# EAGLE design rotary-encoder-breakout-mk-1.1 (EAGLE 6.5.0)
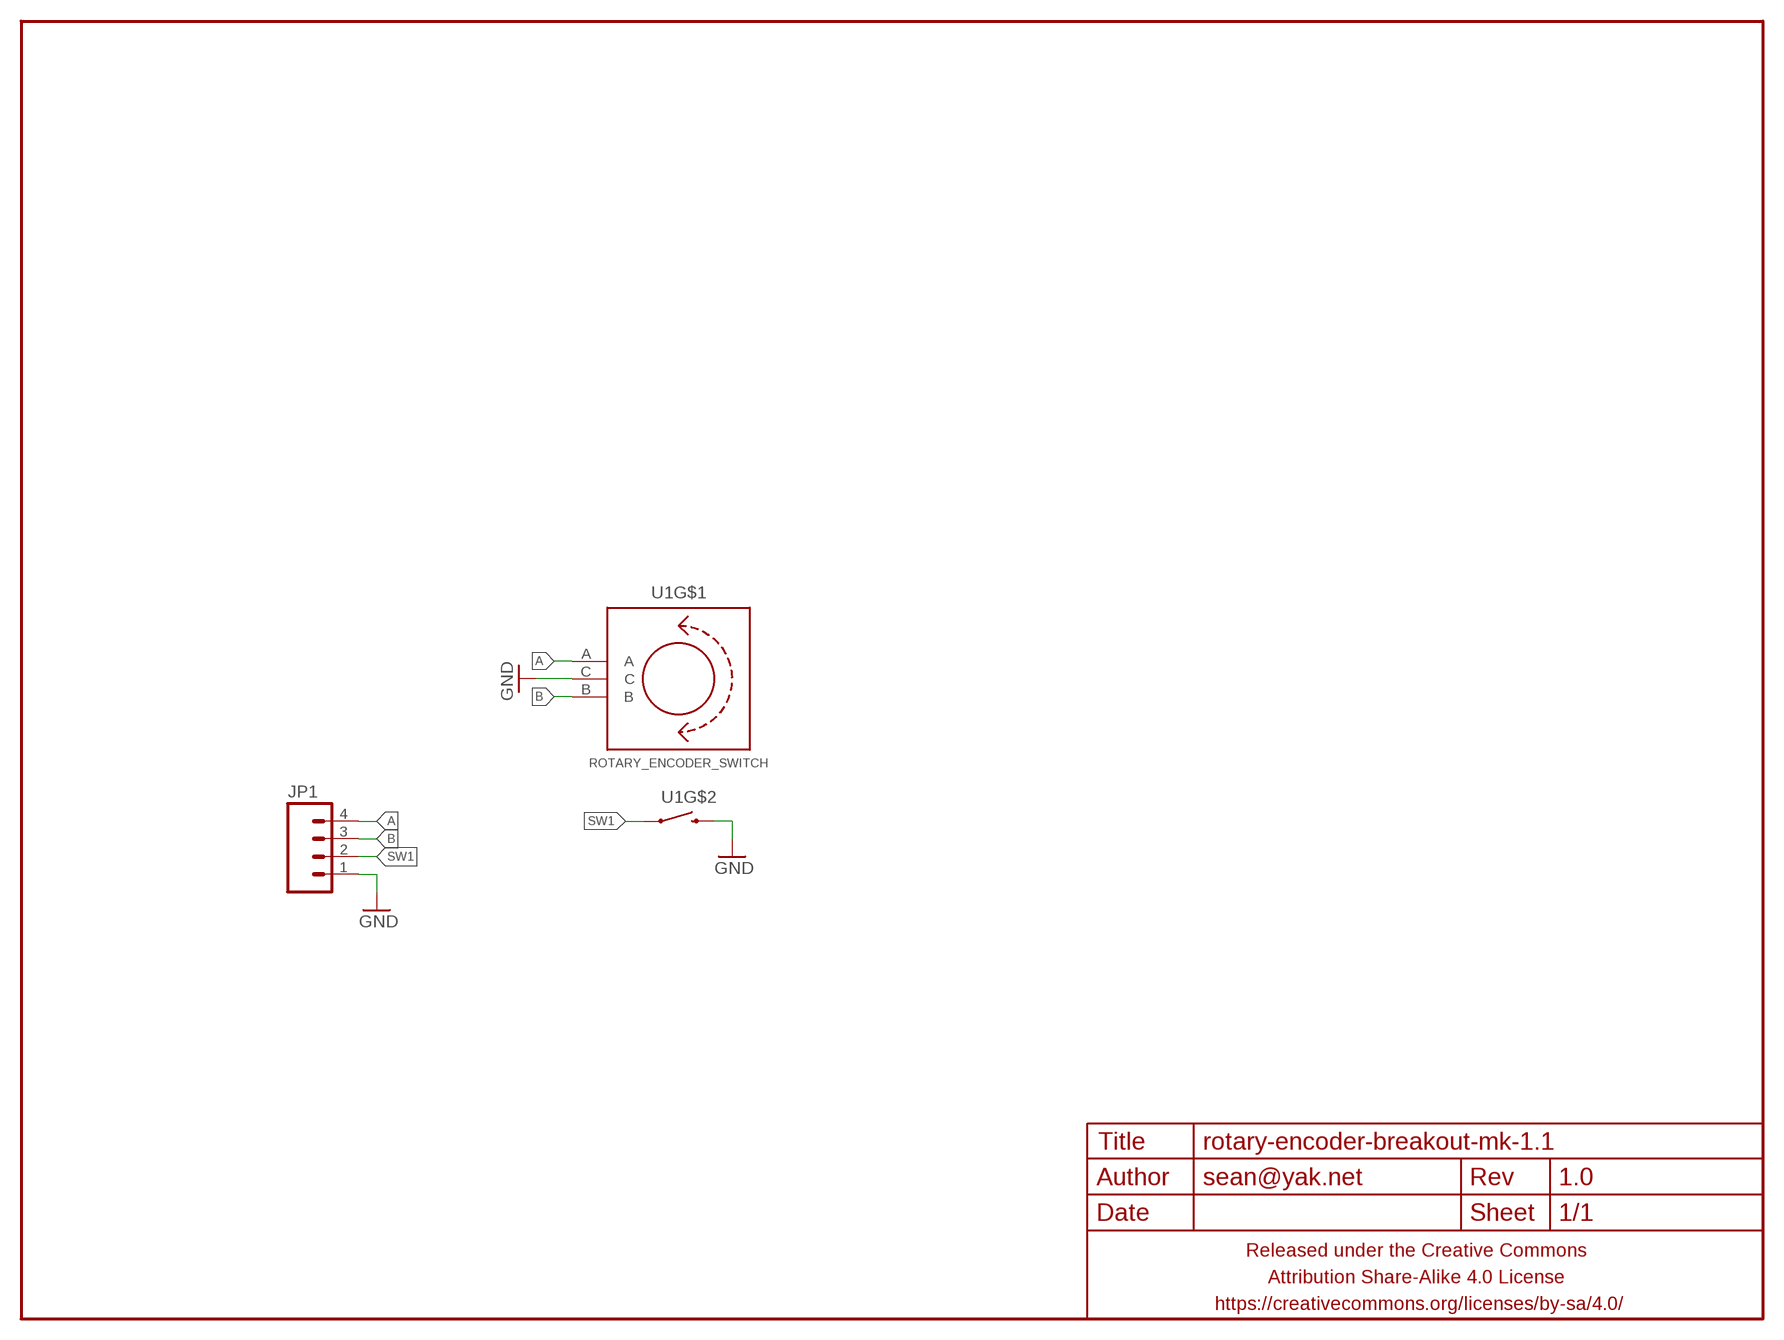
[diagram p0: schematic, sheet 1]

## Parts
FRAME1  FRAME-LETTERNO_PACKAGE  [DUMMY]
JP1  M04PTH  [1X04-PTH-VERT]
U1  ROTARY_ENCODER_SWITCH  [ROTARY_ENCODER_SWITCH]

## Nets
A: JP1.4 U1.A
B: JP1.3 U1.B
GND: JP1.1 U1.C U1.SW2
SW1: JP1.2 U1.SW1

## Library data of the parts
FRAME1 = A_butts:FRAME-LETTER: Schematic Frame Standard 8.5x11 US Letter frame; DESIGNER: sean@yak.net; VERSION: 1.0
JP1 = A_butts:M04: Header 4 Standard 4-pin 0.1" header. Use with straight break away headers (SKU : PRT-00116), right angle break away headers (PRT-00553), swiss pins (PRT-00743), machine pins (PRT-00117), and female headers (PRT-00115). Molex polarized connector foot print use with SKU : PRT-08231 with associated crimp pins and housings. 1MM SMD Version SKU: PRT-10208
U1 = A_butts:ROTARY_ENCODER_SWITCH

## Board
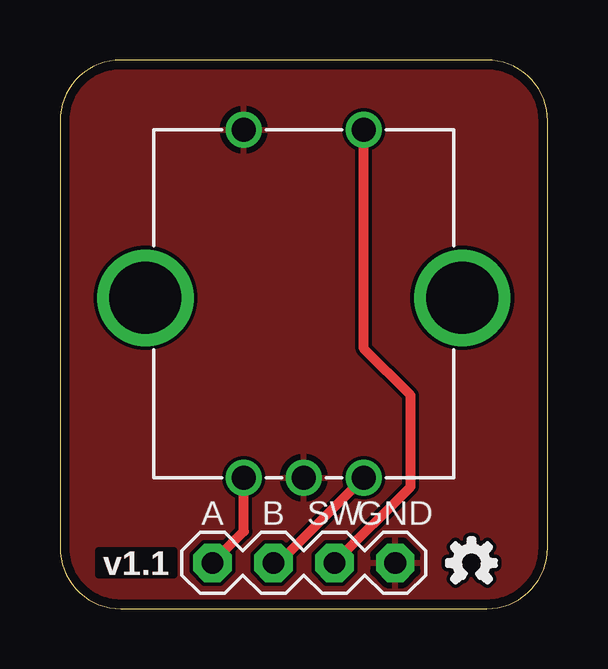
[diagram p1: board, top side]
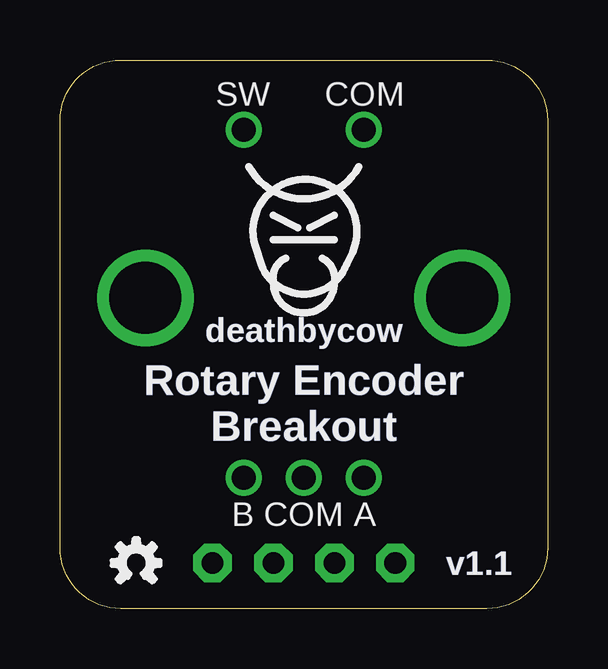
[diagram p2: board, bottom side, seen from below]

Size 20.32 x 22.86 mm. Coordinates in mm from the lower left corner, seen from the top.
Outline: 2.54,0 17.78,0 arc90 20.32,2.54 20.32,20.32 arc90 17.78,22.86 2.54,22.86 arc90 0,20.32 0,2.54 arc90 2.54,0
Copper layers (1*16): Top 0.0356mm / dielectric 1.5011mm / Bottom 0.0356mm
Design rules "LaenPCBOrder2": minimum track width 6mil, minimum drill 13mil, track to track 6mil, track to pad 6mil, pad to pad 6mil, via to via 6mil, smd to smd 6mil, copper to edge 15mil, drill to drill 6mil, minimum pad ring 7mil, minimum via ring 7mil, stop-mask expansion 3mil, vias tented up to drill 20mil, thermal gap 10mil

### Footprints (pad centres in the part's own frame; a part is rotated, then mirrored left to right if it is on the bottom)
1X04-PTH-VERT = drill 0.9 pad 1.6 octagon: 1 0,0; 2 2.54,0; 3 5.08,0; 4 7.62,0
ROTARY_ENCODER_SWITCH = drill 1 pad 1.5: A 7.25,-2.5; B 7.25,2.5; C 7.25,0; SW1 -7.25,2.5; SW2 -7.25,-2.5 | drill 3: P$6 -0.25,6.6; P$7 -0.25,-6.6

### Placement (x,y rotation side)
FRAME1  0,0 90 top
JP1  13.97,1.91 180 top
U1  10.16,12.7 270 top
U$1  [OSHWLOGO_TINY]  17.14,1.91 0 top
U$2  [COW_SMALL_METAL]  10.16,15.88 0 bottom
U$3  [OSHWLOGO_TINY]  17.14,1.91 0 bottom

### Tracks (layer width: path | path; a pad name or v marks a point on that pad's centre or on a via)
A
  Top 0.406: JP1.4 7.66,3.21 U1.A
B
  Top 0.406: JP1.3 9.12,1.91 U1.B
GND
  pour Top: 20.32,20.32 20.32,2.54 arc-90 17.78,0 2.54,0 arc-90 0,2.54 0,20.32 arc-90 2.54,22.86 17.78,22.86 arc-90
SW1
  Top 0.406: JP1.2 14.61,5.08 14.61,8.89 12.66,10.84 U1.SW1

### Text on the board
Bottom: Rotary Encoder / Breakout
tPlace: A | B | SW | GND
bPlace: COM | SW | Rotary Encoder / Breakout | A | COM | B